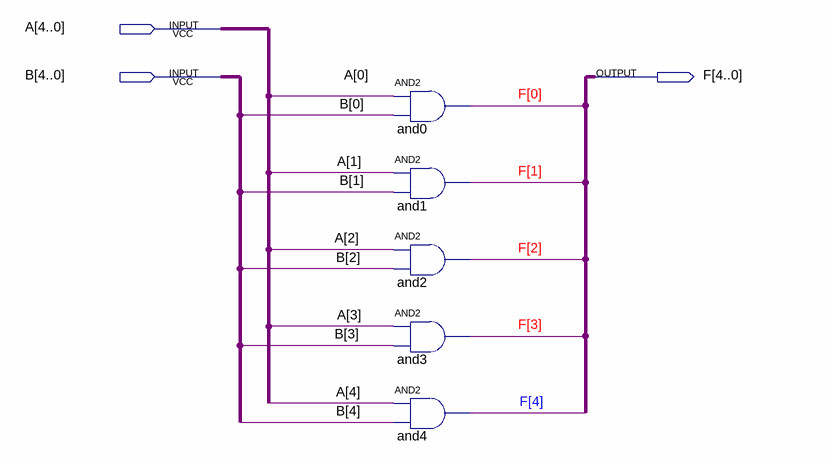
[diagram p0: schematic sheet]
// Quartus schematic AND_110.bdf as structural Verilog: 5 symbols, 3 pins
module AND_110 (
  input  [4:0] A,
  input  [4:0] B,
  output [4:0] F
);

  and and0 (F[0], A[0], B[0]);
  and and1 (F[1], A[1], B[1]);
  and and2 (F[2], A[2], B[2]);
  and and3 (F[3], A[3], B[3]);
  and and4 (F[4], A[4], B[4]);
endmodule
